# EAGLE design E93_Piko_51290_Lichtplatine_V2 (EAGLE 5.10)
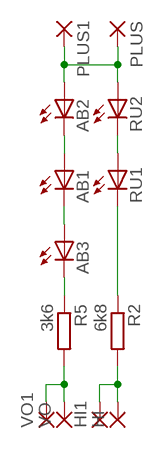
[diagram p0: schematic, sheet 1]

## Parts
AB1  LEDCHIP-LED0603  [CHIP-LED0603]
AB2  LEDCHIP-LED0603  [CHIP-LED0603]
AB3  LEDCHIP-LED0603  [CHIP-LED0603]
HI  SMD2  [SMD1,27-2,54]
HI1  SMD2  [SMD1,27-2,54]
PLUS  SMD2  [SMD1,27-2,54]
PLUS1  SMD2  [SMD1,27-2,54]
R2  6k8  R-EU_R0603  [R0603]
R5  3k6  R-EU_R0603  [R0603]
RU1  LEDCHIP-LED0603  [CHIP-LED0603]
RU2  LEDCHIP-LED0603  [CHIP-LED0603]
VO  SMD2  [SMD1,27-2,54]
VO1  SMD2  [SMD1,27-2,54]

## Nets
N$1: AB1.C AB3.A
N$2: AB3.C R5.1
N$3: R5.2 VO1.1(P) VO.1(P)
N$4: AB1.A AB2.C
N$6: RU1.A RU2.C
N$7: R2.1 RU1.C
N$10: AB2.A PLUS1.1(P) PLUS.1(P) RU2.A
N$13: HI1.1(P) HI.1(P) R2.2

## Library data of the parts
AB1-AB3 RU1 RU2 = led:LED: LED OSRAM: - CHIPLED LG R971, LG N971, LY N971, LG Q971, LY Q971, LO R971, LY R971 LH N974, LH R974 LS Q976, LO Q976, LY Q976 LO Q996 - Hyper CHIPLED LW Q18S LB Q993, LB Q99A, LB R99A - SideLED LS A670, LO A670, LY A670, LG A670, LP A670 LB A673, LV A673, LT A673, LW A673 LH A674 LY A675 LS A676, LA A676, LO A676, LY A676, LW A676 LS A679, LY A679, LG A679 - Hyper Micro SIDELED® LS Y876, LA Y876, LO Y876, LY Y876 LT Y87S - SmartLED LW L88C, LW L88S LB L89C, LB L89S, LG L890 LS L89K, LO L89K, LY L89K LS L896, LA L896, LO L896, LY L896 - TOPLED LS T670, LO T670, LY T670, LG T670, LP T670 LSG T670, LSP T670, LSY T670, LOP T670, LYG T670 LG T671, LOG T671, LSG T671 LB T673, LV T673, LT T673, LW T673 LH T674 LS T676, LA T676, LO T676, LY T676, LB T676, LH T676, LSB T676, LW T676 LB T67C, LV T67C, LT T67C, LS T67K, LO T67K, LY T67K, LW E67C LS E67B, LA E67B, LO E67B, LY E67B, LB E67C, LV E67C, LT E67C LW T67C LS T679, LY T679, LG T679 LS T770, LO T770, LY T770, LG T770, LP T770 LB T773, LV T773, LT T773, LW T773 LH T774 LS E675, LA E675, LY E675, LS T675 LS T776, LA T776, LO T776, LY T776, LB T776 LHGB T686 LT T68C, LB T68C - Hyper Mini TOPLED® LB M676 - Mini TOPLED Santana® LG M470 LS M47K, LO M47K, LY M47K Source: http://www.osram.convergy.de LUXEON: - LUMILED® LXK2-PW12-R00, LXK2-PW12-S00, LXK2-PW14-U00, LXK2-PW14-V00 LXK2-PM12-R00, LXK2-PM12-S00, LXK2-PM14-U00 LXK2-PE12-Q00, LXK2-PE12-R00, LXK2-PE12-S00, LXK2-PE14-T00, LXK2-PE14-U00 LXK2-PB12-K00, LXK2-PB12-L00, LXK2-PB12-M00, LXK2-PB14-N00, LXK2-PB14-P00, LXK2-PB14-Q00 LXK2-PR12-L00, LXK2-PR12-M00, LXK2-PR14-Q00, LXK2-PR14-R00 LXK2-PD12-Q00, LXK2-PD12-R00, LXK2-PD12-S00 LXK2-PH12-R00, LXK2-PH12-S00 LXK2-PL12-P00, LXK2-PL12-Q00, LXK2-PL12-R00 Source: www.luxeon.com KINGBRIGHT: KA-3528ASYC Source: www.kingbright.com
HI HI1 PLUS PLUS1 VO VO1 = wirepad:SMD2: SMD PAD
R2 R5 = rcl:R-EU_: RESISTOR, European symbol

## Board
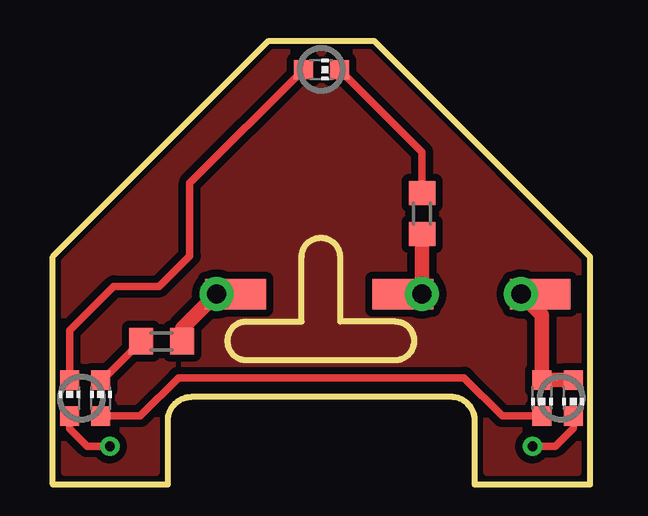
[diagram p1: board, top side]
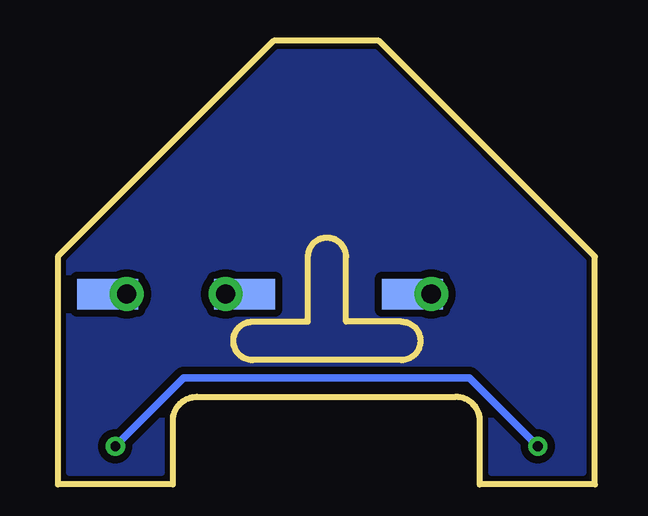
[diagram p2: board, bottom side, seen from below]

No outline drawn. Coordinates in mm, seen from the top.
Copper layers (1*16): Top 0.035mm / dielectric 1.5mm / Bottom 0.035mm
Design rules "default *": minimum track width 7mil, minimum drill 0.6mm, track to track 8mil, track to pad 8mil, pad to pad 8mil, via to via 8mil, smd to smd 8mil, copper to edge 40mil, drill to drill 8mil, minimum pad ring 10mil, minimum via ring 8mil, stop-mask expansion 4mil, vias tented up to drill 0mil, thermal gap 10mil
tKeepout: area 0,9.5 to 4.5,14; area 17.9,9.5 to 22.4,14
bKeepout: area 1,9 to 21.4,18.5; area 0,0 to 22.4,6.8
Milling: 23 lines

### Footprints (pad centres in the part's own frame; a part is rotated, then mirrored left to right if it is on the bottom)
CHIP-LED0603 = smd 0.8 x 0.8: A 0,-0.75; C 0,0.75
SMD1,27-2,54 = smd 1.27 x 2.54: 1 0,0
R0603 = smd 1 x 1.1: 1 -0.85,0; 2 0.85,0

### Placement (x,y rotation side)
AB1  0.7,3.6 0 top
AB2  21.7,3.6 180 top
AB3  11.2,17.3 270 top
HI  7.62,7.94 270 bottom
HI1  7.62,7.94 90 top
PLUS  20.32,7.94 90 bottom
PLUS1  20.32,7.94 90 top
R2  4.54,5.97 0 top
R5  15.4,11.3 270 top
RU1  2,3.6 0 top
RU2  20.4,3.6 180 top
VO  14.61,7.94 90 bottom
VO1  14.61,7.94 90 top

### Tracks (layer width: path | path; a pad name or v marks a point on that pad's centre or on a via)
N$1
  Top 0.305: AB1.C 0.7,6.42 2.54,8.26 4.45,8.26 5.71,9.53 5.71,12.56 AB3.A
N$2
  Top 0.305: R5.1 15.4,13.85 AB3.C
N$3  (via drill 0.8 pad 1.42)
  Top 0.61: v15.4,7.94 R5.2 | v15.4,7.94 VO.1 | v15.4,7.94 | v15.4,7.94 VO.1 | VO.1
  Bottom 0.61: VO.1 v15.4,7.94 | v15.4,7.94
N$4  (via drill 0.4)
  Top 0.305: AB1.A 0.7,2.32 1.43,1.59 v2.38,1.59 | AB2.C 21.7,2.33 20.95,1.59 v20,1.59
  Bottom 0.305: v2.38,1.59 5.24,4.45 17.14,4.45 v20,1.59
N$6
  Top 0.305: RU1.A 3.64,2.85 5.24,4.45 17.14,4.45 18.74,2.85 RU2.C
N$7
  Top 0.305: RU1.C 2.07,4.35 R2.1
N$9
  pour Top (isolate 0.305): 0.5,0.5 0.5,9.3 9.2,18 13.2,18 14.8,16.4 21.9,9.3 21.9,0.5 18.1,0.5 18.1,2.6 arc90 16.55,4.15 5.8,4.15 arc90 4.3,2.65 4.3,0.5
  pour Bottom (isolate 0.305): 0.5,0.5 0.5,9.3 9.2,18 13.2,18 14.8,16.4 21.9,9.3 21.9,0.5 18.1,0.5 18.1,2.6 arc90 16.55,4.15 5.8,4.15 arc90 4.3,2.65 4.3,0.5
N$10  (via drill 0.8 pad 1.42)
  Top 0.61: AB2.A RU2.A 20.4,7.06 v19.53,7.94 PLUS1.1
  Bottom 0.61: v19.53,7.94 PLUS1.1
N$13  (via drill 0.8 pad 1.42)
  Top 0.61: R2.2 5.39,6.5 v6.83,7.94 | v6.83,7.94 HI1.1 | v6.83,7.94
  Bottom 0.61: v6.83,7.94 HI1.1

### Text on the board
tStop: E93 LED | H | V | +
bStop: design by Janik Merz | E93 LED | Für Piko 51290 | H | V | +